# EasyEDA Pro project EasyEda.epro, schematic Left Hand
Board Name: Left Hand; Create Date: 2025-06-04; Page Name: Left Hand; Project Name: Splitto Dogu 2; Schematic Name: Left Hand; Update Date: 2025-06-05; Company: TimoStrube.de; Drawn: Timo; Page Size: A4; Reviewed: Timo; Version: v1.3
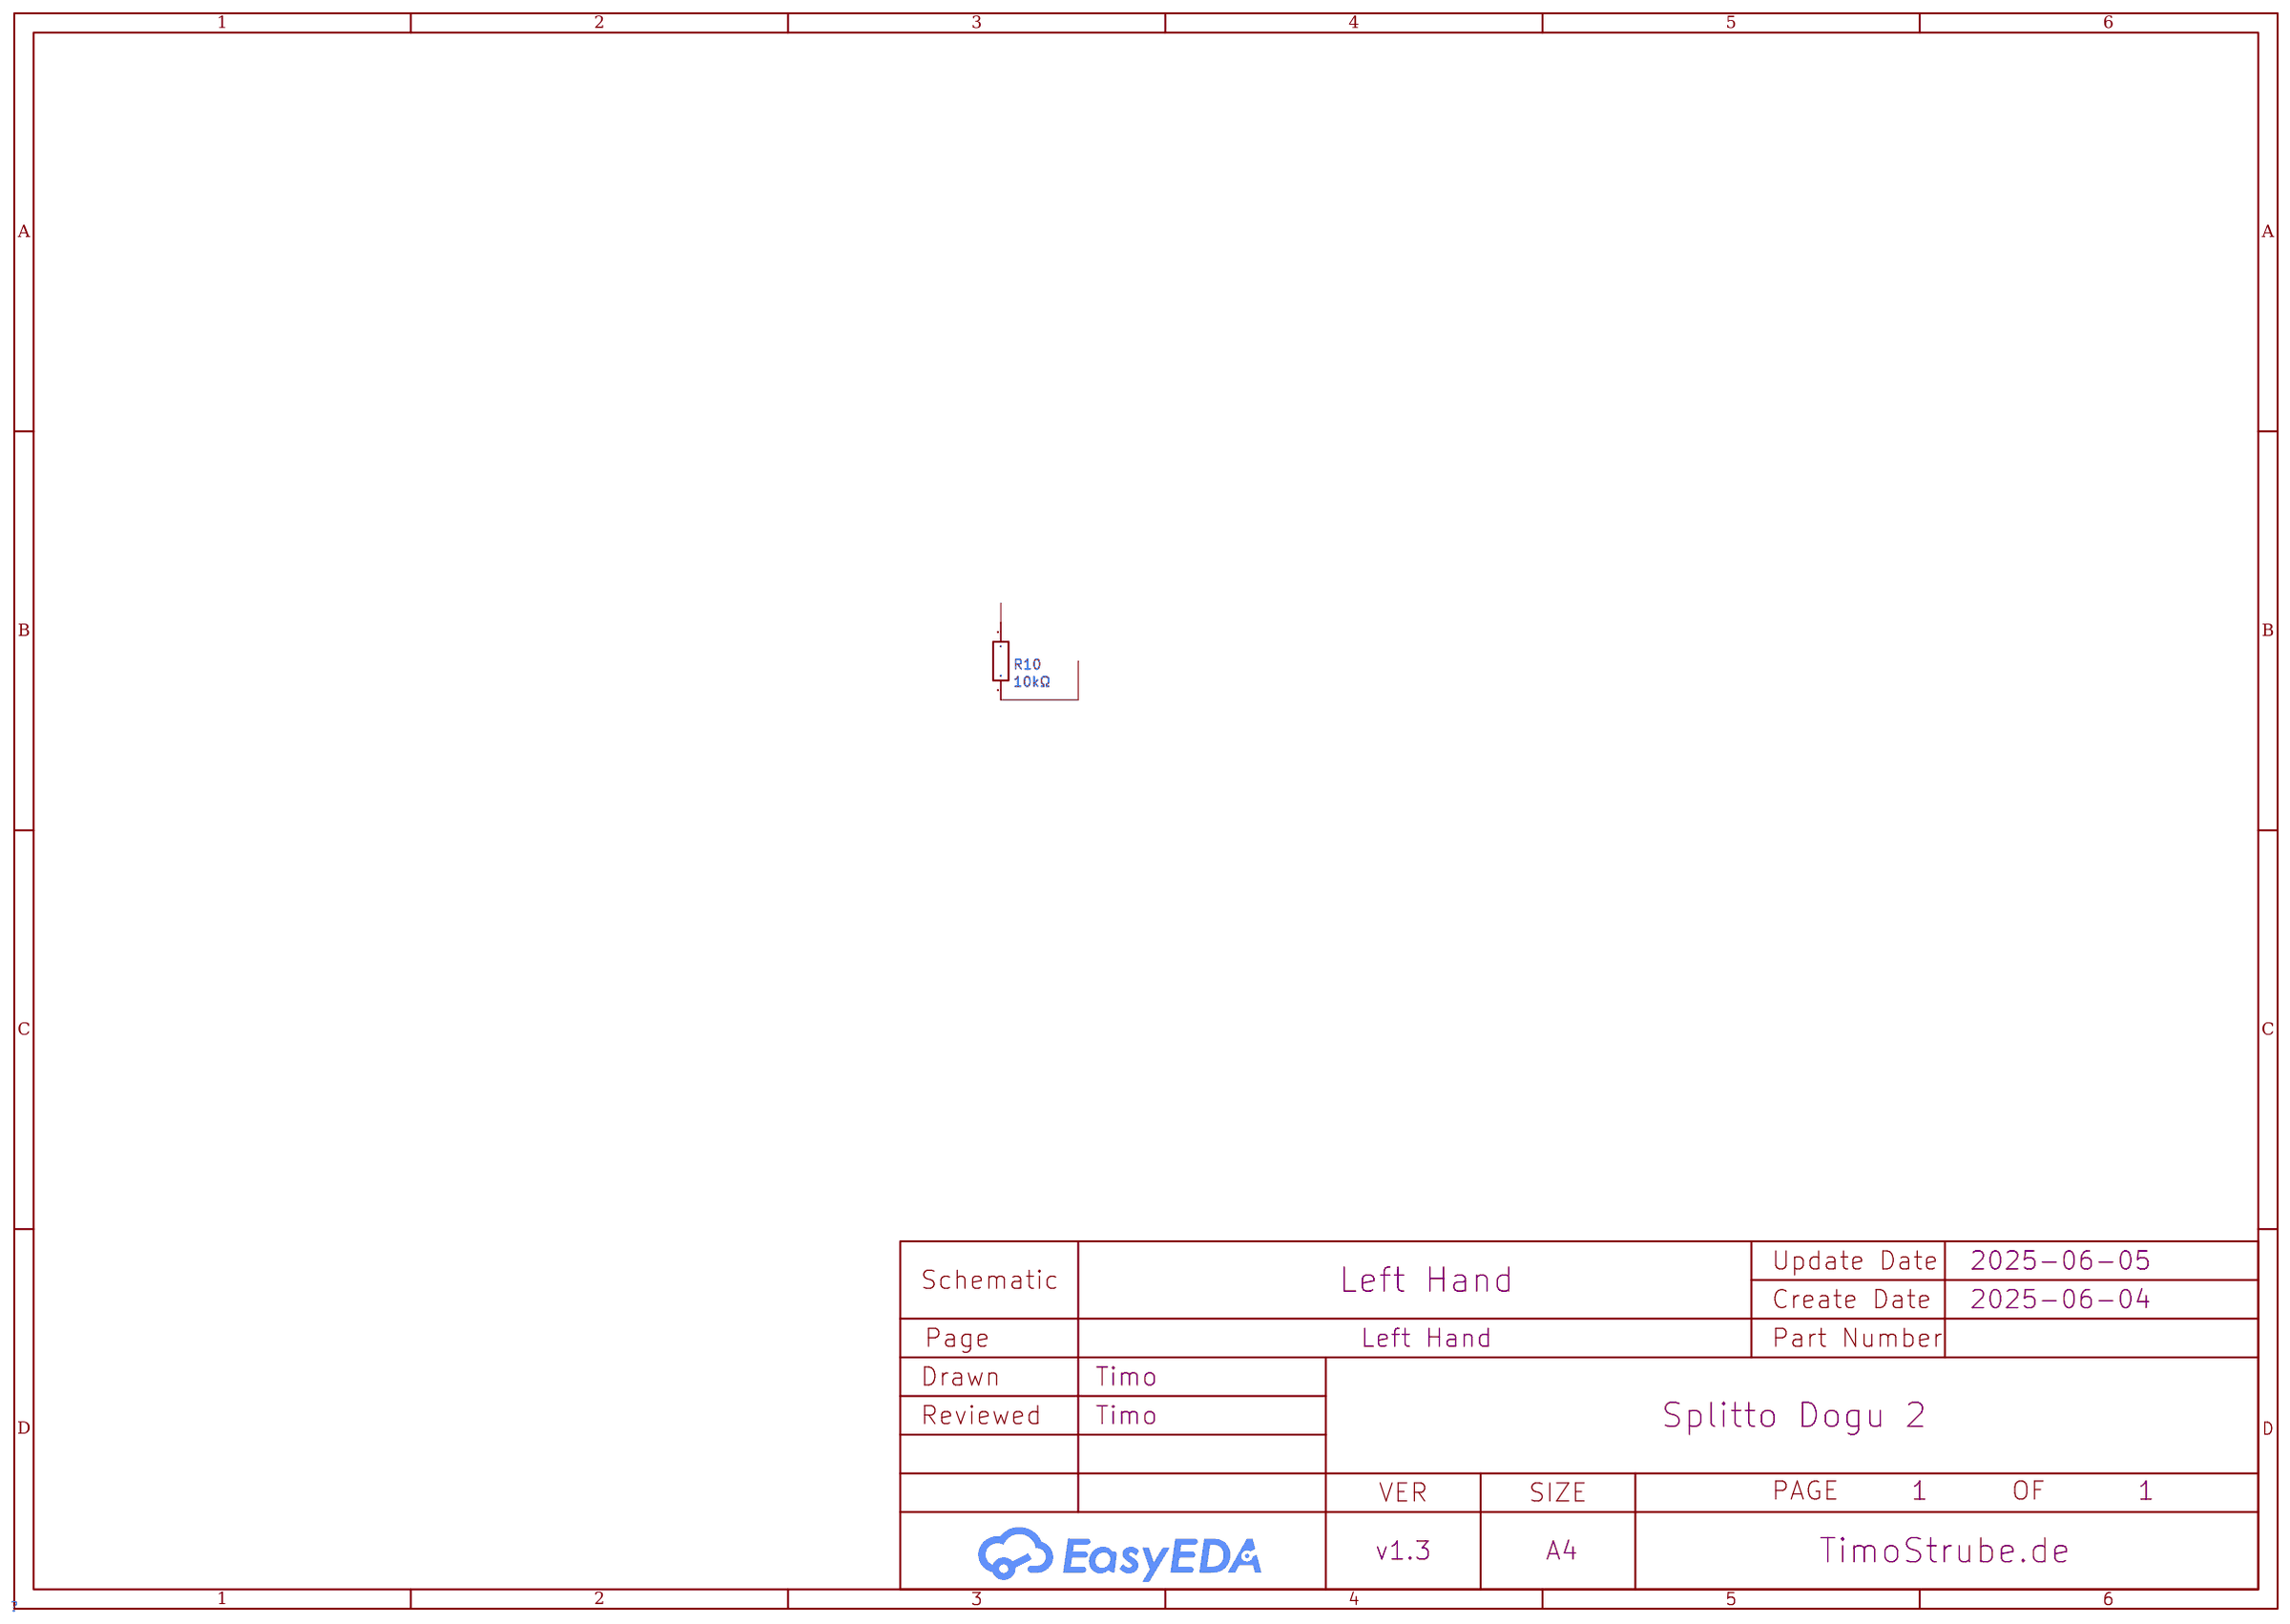
[diagram p0: schematic sheet]

## Parts
CBB1  -
R10  10kΩ  [R0402]

## Library data of the parts
R10 = 10kΩ: Supplier: LCSC; Manufacturer: UNI-ROYAL(厚声); Manufacturer Part: 0402WGF1002TCE; Supplier Part: C25744; JLCPCB Part Class: Basic Part; nameAlias: Value; spicePre: R; spiceSymbolName: 0402WGF1002TCE

## Nets
Net-(CBB1-): CBB1.(3V3) R10.1 R10.2
